# Altium project PROC154E3_SCH.PrjPcb (part 7 of 60)
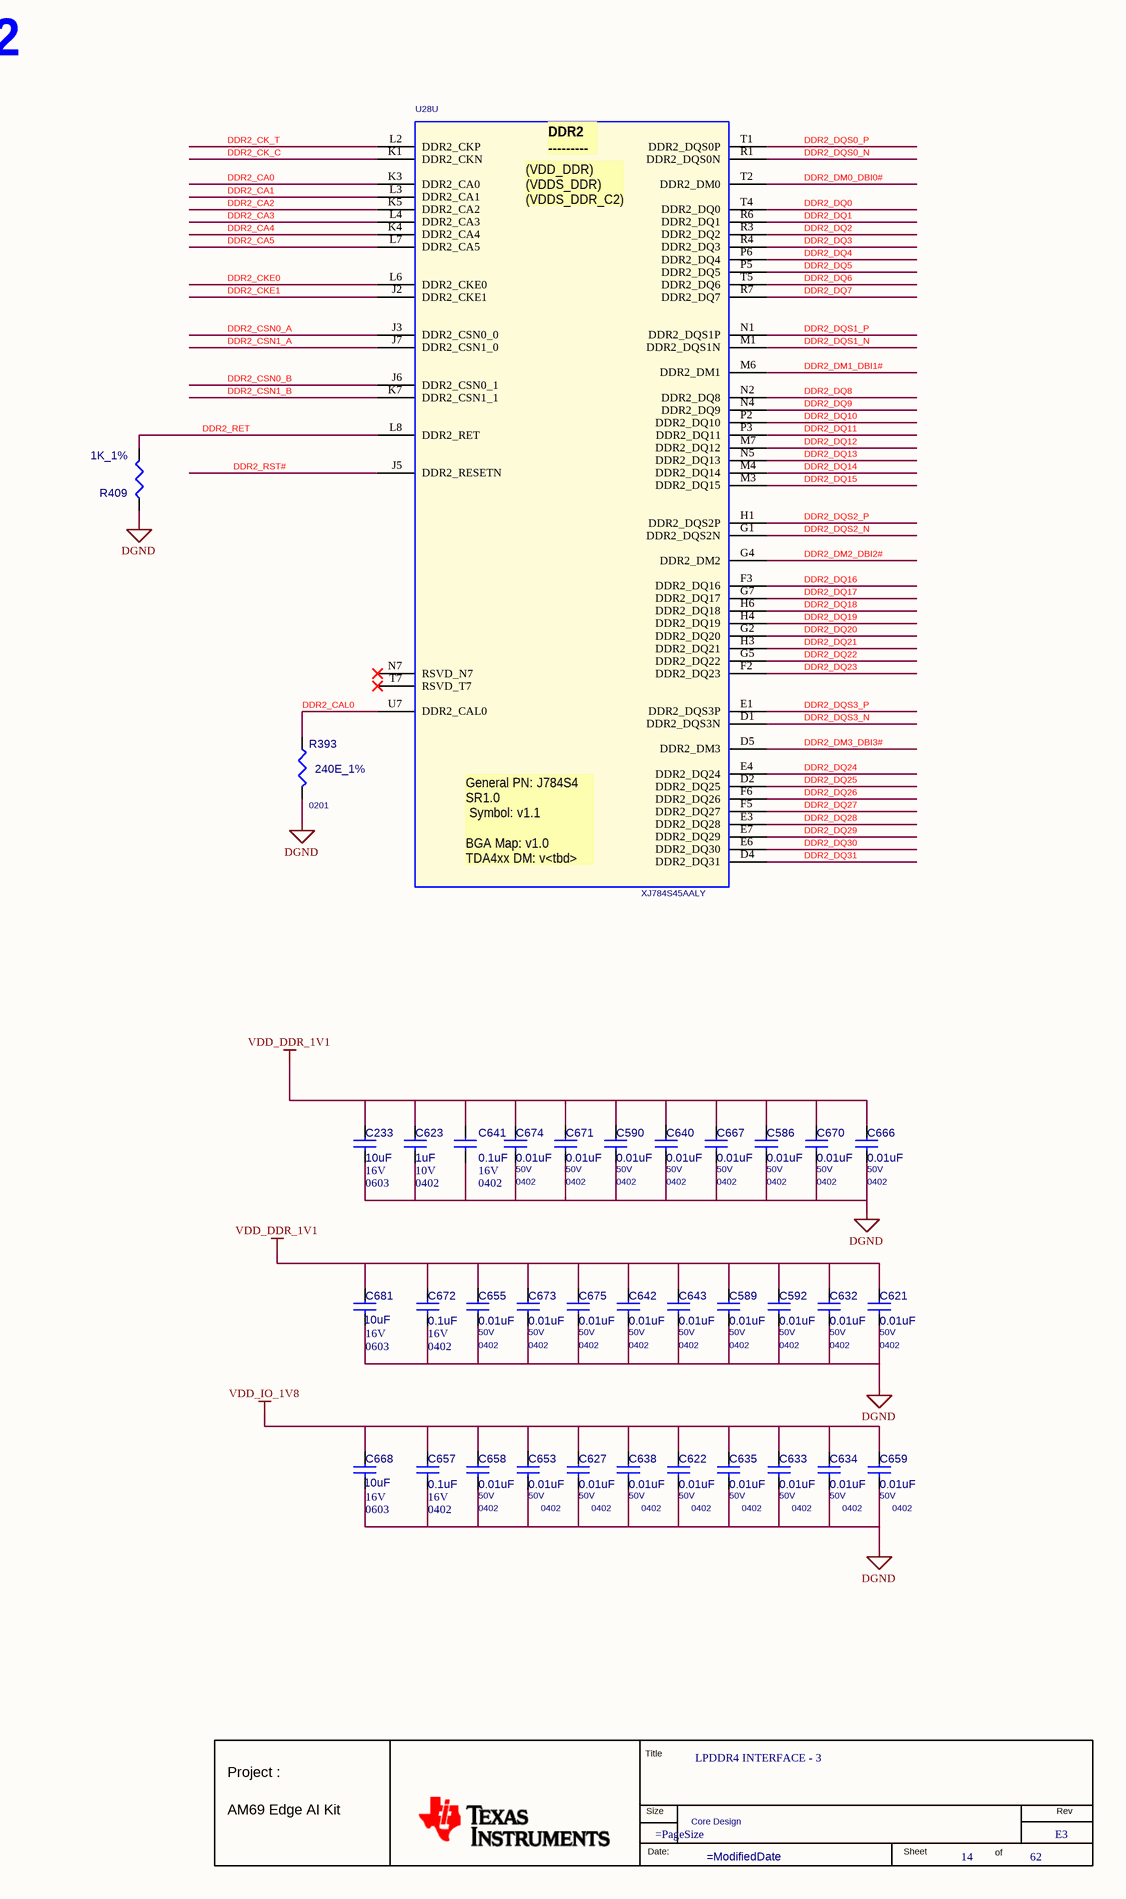
[diagram p121: 14. SOC EMIF2 & LPDDR4.SchDoc, right]

## Sheet 14. SOC EMIF2 & LPDDR4.SchDoc: LPDDR4 INTERFACE - 3 (continued)

### Library data of the parts
*#14 = MISTRAL_TITLEBLK_CSIZE_1: Issue: 1.0; Project: PROC154E2(001)_SK_AM69; Name: PROC154E2 001 SK AM69; Page Create Date: March  8, 1995; Page Size: =PageSize; Page Modify Date: =ModifiedDate; Schematic Page Count: 62; Schematic Page Number: 14
C233 = CAP_Dup1: CAP CERAMIC 10uF 16V 20% X6S 0603; Part Reference: C233; Automotive Alternate_mfr_part_number: GRT188C81C106ME13D; Automotive Alternate_mfr_name: MURATA; Direct Alternate_mfr_part_number: CL10X106MO8NRNC; Direct Alternate_mfr_name: SAMSUNG; Part_type: CAPACITORS\CERAMIC; Mfr_part_number: GRM188C81C106MA73D; Mistral Part No: 120017010004-R; Custom_Duty: 15%; Customs_HS_Code: 85322990; Wattage: NA; Project: TRMM_SMART-M_PS; Value: 10uF; PCB Footprint: CAP0603_1; Footprint Path: Y:\MIS_DATABASE\Library\ALTIUM_TOOL\PCB_FOOTPRINTS\Altium_Footprint_Lib.PcbLib; Library Path: Y:\MIS_DATABASE\Library\ALTIUM_TOOL\SCHEMATICS_PARTS\MS_DISCRETE_Library.schlib; Footprint Ref: CAP0603_1; MECHANICAL 3D STEP FILE: CAP0603_1; Chkd/date: VASANTHA/170117; Crtd /date: VASANTHA/170117; Datasheet: Y:\MIS_DATABASE\DATASHEETS\CAPACITORS\MURATA-GXX-SER_NOV17.PDF; Temperature: -55°C+105°C; Weight: 6.3mg; Height: 0.90MM; Library Ref: CAP; Distributor_part_number: 490-7198-1-ND; Distributor_name: DIGIKEY; Tolerance: 20%; Mfr_name: MURATA
C586 = CAP_Dup1: CAP CERAMIC 0.01uF 50V 10% X7R 0402; Part Reference: C586; Automotive Alternate_mfr_part_number: CGA2B3X7R1H103K050BB; Automotive Alternate_mfr_name: TDK; Direct Alternate_mfr_part_number: C1005X7R1H103K050BE; Mistral Part No: 120009030025-R; Mfr_name: KEMET; Mfr_part_number: C0402C103K5RACTU; Part_type: CAPACITORS\CERAMIC; Wattage: NA; Project: G4_SVGA; Customs_HS_Code: 85322990; Custom_Duty: 15%; Value: 0.01uF; PCB Footprint: CAP0402_0-75; Direct Alternate_mfr_name: TDK; Footprint Path: Y:\MIS_DATABASE\Library\ALTIUM_TOOL\PCB_FOOTPRINTS\Altium_Footprint_Lib.PcbLib; Library Path: Y:\MIS_DATABASE\Library\ALTIUM_TOOL\SCHEMATICS_PARTS\MS_DISCRETE_Library.schlib; MECHANICAL 3D STEP FILE: CAP0402_0-75; Temperature: -55°C+125°C; Weight: 0.65mg; Footprint Ref: CAP0402_0-75; Tolerance: 10%; Distributor_name: DIGIKEY; Distributor_part_number: 399-3066-1-ND; Library Ref: CAP; Height: 0.55MM; Datasheet: Y:\MIS_DATABASE\DATASHEETS\CAPACITORS\KEMET-C-X7R.PDF; Crtd /date: MAZHAR/040505; Chkd/date: SHREESHAIL/301105
C589 = CAP_Dup1: CAP CERAMIC 0.01uF 50V 10% X7R 0402; Part Reference: C589; Automotive Alternate_mfr_part_number: CGA2B3X7R1H103K050BB; Automotive Alternate_mfr_name: TDK; Direct Alternate_mfr_part_number: C1005X7R1H103K050BE; Mistral Part No: 120009030025-R; Mfr_name: KEMET; Mfr_part_number: C0402C103K5RACTU; Part_type: CAPACITORS\CERAMIC; Wattage: NA; Project: G4_SVGA; Customs_HS_Code: 85322990; Custom_Duty: 15%; Value: 0.01uF; PCB Footprint: CAP0402_0-75; Direct Alternate_mfr_name: TDK; Footprint Path: Y:\MIS_DATABASE\Library\ALTIUM_TOOL\PCB_FOOTPRINTS\Altium_Footprint_Lib.PcbLib; Library Path: Y:\MIS_DATABASE\Library\ALTIUM_TOOL\SCHEMATICS_PARTS\MS_DISCRETE_Library.schlib; MECHANICAL 3D STEP FILE: CAP0402_0-75; Temperature: -55°C+125°C; Weight: 0.65mg; Footprint Ref: CAP0402_0-75; Tolerance: 10%; Distributor_name: DIGIKEY; Distributor_part_number: 399-3066-1-ND; Library Ref: CAP; Height: 0.55MM; Datasheet: Y:\MIS_DATABASE\DATASHEETS\CAPACITORS\KEMET-C-X7R.PDF; Crtd /date: MAZHAR/040505; Chkd/date: SHREESHAIL/301105
C590 = CAP_Dup1: CAP CERAMIC 0.01uF 50V 10% X7R 0402; Part Reference: C590; Automotive Alternate_mfr_part_number: CGA2B3X7R1H103K050BB; Automotive Alternate_mfr_name: TDK; Direct Alternate_mfr_part_number: C1005X7R1H103K050BE; Mistral Part No: 120009030025-R; Mfr_name: KEMET; Mfr_part_number: C0402C103K5RACTU; Part_type: CAPACITORS\CERAMIC; Wattage: NA; Project: G4_SVGA; Customs_HS_Code: 85322990; Custom_Duty: 15%; Value: 0.01uF; PCB Footprint: CAP0402_0-75; Direct Alternate_mfr_name: TDK; Footprint Path: Y:\MIS_DATABASE\Library\ALTIUM_TOOL\PCB_FOOTPRINTS\Altium_Footprint_Lib.PcbLib; Library Path: Y:\MIS_DATABASE\Library\ALTIUM_TOOL\SCHEMATICS_PARTS\MS_DISCRETE_Library.schlib; MECHANICAL 3D STEP FILE: CAP0402_0-75; Temperature: -55°C+125°C; Weight: 0.65mg; Footprint Ref: CAP0402_0-75; Tolerance: 10%; Distributor_name: DIGIKEY; Distributor_part_number: 399-3066-1-ND; Library Ref: CAP; Height: 0.55MM; Datasheet: Y:\MIS_DATABASE\DATASHEETS\CAPACITORS\KEMET-C-X7R.PDF; Crtd /date: MAZHAR/040505; Chkd/date: SHREESHAIL/301105
C592 = CAP_Dup1: CAP CERAMIC 0.01uF 50V 10% X7R 0402; Part Reference: C592; Automotive Alternate_mfr_part_number: CGA2B3X7R1H103K050BB; Automotive Alternate_mfr_name: TDK; Direct Alternate_mfr_part_number: C1005X7R1H103K050BE; Part_type: CAPACITORS\CERAMIC; Mfr_part_number: C0402C103K5RACTU; Mfr_name: KEMET; Mistral Part No: 120009030025-R; Wattage: NA; Custom_Duty: 15%; Customs_HS_Code: 85322990; Project: G4_SVGA; Value: 0.01uF; PCB Footprint: CAP0402_0-75; Direct Alternate_mfr_name: TDK; Footprint Path: Y:\MIS_DATABASE\Library\ALTIUM_TOOL\PCB_FOOTPRINTS\Altium_Footprint_Lib.PcbLib; Library Path: Y:\MIS_DATABASE\Library\ALTIUM_TOOL\SCHEMATICS_PARTS\MS_DISCRETE_Library.schlib; MECHANICAL 3D STEP FILE: CAP0402_0-75; Temperature: -55°C+125°C; Weight: 0.65mg; Footprint Ref: CAP0402_0-75; Chkd/date: SHREESHAIL/301105; Crtd /date: MAZHAR/040505; Datasheet: Y:\MIS_DATABASE\DATASHEETS\CAPACITORS\KEMET-C-X7R.PDF; Height: 0.55MM; Library Ref: CAP; Distributor_part_number: 399-3066-1-ND; Distributor_name: DIGIKEY; Tolerance: 10%
C621 = CAP_Dup1: CAP CERAMIC 0.01uF 50V 10% X7R 0402; Part Reference: C621; Automotive Alternate_mfr_part_number: CGA2B3X7R1H103K050BB; Automotive Alternate_mfr_name: TDK; Direct Alternate_mfr_part_number: C1005X7R1H103K050BE; Part_type: CAPACITORS\CERAMIC; Mfr_part_number: C0402C103K5RACTU; Mfr_name: KEMET; Mistral Part No: 120009030025-R; Wattage: NA; Custom_Duty: 15%; Customs_HS_Code: 85322990; Project: G4_SVGA; Value: 0.01uF; PCB Footprint: CAP0402_0-75; Direct Alternate_mfr_name: TDK; Footprint Path: Y:\MIS_DATABASE\Library\ALTIUM_TOOL\PCB_FOOTPRINTS\Altium_Footprint_Lib.PcbLib; Library Path: Y:\MIS_DATABASE\Library\ALTIUM_TOOL\SCHEMATICS_PARTS\MS_DISCRETE_Library.schlib; MECHANICAL 3D STEP FILE: CAP0402_0-75; Temperature: -55°C+125°C; Weight: 0.65mg; Footprint Ref: CAP0402_0-75; Chkd/date: SHREESHAIL/301105; Crtd /date: MAZHAR/040505; Datasheet: Y:\MIS_DATABASE\DATASHEETS\CAPACITORS\KEMET-C-X7R.PDF; Height: 0.55MM; Library Ref: CAP; Distributor_part_number: 399-3066-1-ND; Distributor_name: DIGIKEY; Tolerance: 10%
C622 = CAP_Dup1: CAP CERAMIC 0.01uF 50V 10% X7R 0402; Part Reference: C622; Automotive Alternate_mfr_part_number: CGA2B3X7R1H103K050BB; Automotive Alternate_mfr_name: TDK; Direct Alternate_mfr_part_number: C1005X7R1H103K050BE; Mistral Part No: 120009030025-R; Mfr_name: KEMET; Mfr_part_number: C0402C103K5RACTU; Part_type: CAPACITORS\CERAMIC; Wattage: NA; Project: G4_SVGA; Customs_HS_Code: 85322990; Custom_Duty: 15%; Value: 0.01uF; PCB Footprint: CAP0402_0-75; Direct Alternate_mfr_name: TDK; Footprint Path: Y:\MIS_DATABASE\Library\ALTIUM_TOOL\PCB_FOOTPRINTS\Altium_Footprint_Lib.PcbLib; Library Path: Y:\MIS_DATABASE\Library\ALTIUM_TOOL\SCHEMATICS_PARTS\MS_DISCRETE_Library.schlib; MECHANICAL 3D STEP FILE: CAP0402_0-75; Temperature: -55°C+125°C; Weight: 0.65mg; Footprint Ref: CAP0402_0-75; Tolerance: 10%; Distributor_name: DIGIKEY; Distributor_part_number: 399-3066-1-ND; Library Ref: CAP; Height: 0.55MM; Datasheet: Y:\MIS_DATABASE\DATASHEETS\CAPACITORS\KEMET-C-X7R.PDF; Crtd /date: MAZHAR/040505; Chkd/date: SHREESHAIL/301105
C623 = CAP_Dup1: CAP CERAMIC 1uF 10V 10% X7S AUTO 0402; Part Reference: C623; Mistral Part No: 120018090021-R; Mfr_name: MURATA; Mfr_part_number: GCM155C71A105KE38D; Part_type: CAPACITORS\CERAMIC; Project: SMART-M_SCRIPTALK_PB; Wattage: NA; Customs_HS_Code: 85322990; Custom_Duty: 15%; Value: 1uF; PCB Footprint: CAP0402_0-75; Footprint Ref: CAP0402_0-75; Library Ref: CAP; Tolerance: 10%; Distributor_name: DIGIKEY; Distributor_part_number: 490-13409-1-ND; Height: 0.70MM; Weight: 6mg; Temperature: -55°C+125°C; Datasheet: Y:\MIS_DATABASE\DATASHEETS\CAPACITORS\MURATA-GCM-SER.PDF; Crtd /date: ALVY/100918; Chkd/date: MANIRAJA/100918; MECHANICAL 3D STEP FILE: CAP0402_0-75; Library Path: Y:\MIS_DATABASE\Library\ALTIUM_TOOL\SCHEMATICS_PARTS\MS_DISCRETE_Library.schlib; Footprint Path: Y:\MIS_DATABASE\Library\ALTIUM_TOOL\PCB_FOOTPRINTS\Altium_Footprint_Lib.PcbLib
C627 = CAP_Dup1: CAP CERAMIC 0.01uF 50V 10% X7R 0402; Part Reference: C627; Automotive Alternate_mfr_part_number: CGA2B3X7R1H103K050BB; Automotive Alternate_mfr_name: TDK; Direct Alternate_mfr_part_number: C1005X7R1H103K050BE; Part_type: CAPACITORS\CERAMIC; Mfr_part_number: C0402C103K5RACTU; Mfr_name: KEMET; Mistral Part No: 120009030025-R; Wattage: NA; Custom_Duty: 15%; Customs_HS_Code: 85322990; Project: G4_SVGA; Value: 0.01uF; PCB Footprint: CAP0402_0-75; Direct Alternate_mfr_name: TDK; Footprint Path: Y:\MIS_DATABASE\Library\ALTIUM_TOOL\PCB_FOOTPRINTS\Altium_Footprint_Lib.PcbLib; Library Path: Y:\MIS_DATABASE\Library\ALTIUM_TOOL\SCHEMATICS_PARTS\MS_DISCRETE_Library.schlib; MECHANICAL 3D STEP FILE: CAP0402_0-75; Temperature: -55°C+125°C; Weight: 0.65mg; Footprint Ref: CAP0402_0-75; Chkd/date: SHREESHAIL/301105; Crtd /date: MAZHAR/040505; Datasheet: Y:\MIS_DATABASE\DATASHEETS\CAPACITORS\KEMET-C-X7R.PDF; Height: 0.55MM; Library Ref: CAP; Distributor_part_number: 399-3066-1-ND; Distributor_name: DIGIKEY; Tolerance: 10%
C632 = CAP_Dup1: CAP CERAMIC 0.01uF 50V 10% X7R 0402; Part Reference: C632; Automotive Alternate_mfr_part_number: CGA2B3X7R1H103K050BB; Automotive Alternate_mfr_name: TDK; Direct Alternate_mfr_part_number: C1005X7R1H103K050BE; Mistral Part No: 120009030025-R; Mfr_name: KEMET; Mfr_part_number: C0402C103K5RACTU; Part_type: CAPACITORS\CERAMIC; Wattage: NA; Project: G4_SVGA; Customs_HS_Code: 85322990; Custom_Duty: 15%; Value: 0.01uF; PCB Footprint: CAP0402_0-75; Direct Alternate_mfr_name: TDK; Footprint Path: Y:\MIS_DATABASE\Library\ALTIUM_TOOL\PCB_FOOTPRINTS\Altium_Footprint_Lib.PcbLib; Library Path: Y:\MIS_DATABASE\Library\ALTIUM_TOOL\SCHEMATICS_PARTS\MS_DISCRETE_Library.schlib; MECHANICAL 3D STEP FILE: CAP0402_0-75; Temperature: -55°C+125°C; Weight: 0.65mg; Footprint Ref: CAP0402_0-75; Tolerance: 10%; Distributor_name: DIGIKEY; Distributor_part_number: 399-3066-1-ND; Library Ref: CAP; Height: 0.55MM; Datasheet: Y:\MIS_DATABASE\DATASHEETS\CAPACITORS\KEMET-C-X7R.PDF; Crtd /date: MAZHAR/040505; Chkd/date: SHREESHAIL/301105
C633 = CAP_Dup1: CAP CERAMIC 0.01uF 50V 10% X7R 0402; Part Reference: C633; Automotive Alternate_mfr_part_number: CGA2B3X7R1H103K050BB; Automotive Alternate_mfr_name: TDK; Direct Alternate_mfr_part_number: C1005X7R1H103K050BE; Mistral Part No: 120009030025-R; Mfr_name: KEMET; Mfr_part_number: C0402C103K5RACTU; Part_type: CAPACITORS\CERAMIC; Wattage: NA; Project: G4_SVGA; Customs_HS_Code: 85322990; Custom_Duty: 15%; Value: 0.01uF; PCB Footprint: CAP0402_0-75; Direct Alternate_mfr_name: TDK; Footprint Path: Y:\MIS_DATABASE\Library\ALTIUM_TOOL\PCB_FOOTPRINTS\Altium_Footprint_Lib.PcbLib; Library Path: Y:\MIS_DATABASE\Library\ALTIUM_TOOL\SCHEMATICS_PARTS\MS_DISCRETE_Library.schlib; MECHANICAL 3D STEP FILE: CAP0402_0-75; Temperature: -55°C+125°C; Weight: 0.65mg; Footprint Ref: CAP0402_0-75; Tolerance: 10%; Distributor_name: DIGIKEY; Distributor_part_number: 399-3066-1-ND; Library Ref: CAP; Height: 0.55MM; Datasheet: Y:\MIS_DATABASE\DATASHEETS\CAPACITORS\KEMET-C-X7R.PDF; Crtd /date: MAZHAR/040505; Chkd/date: SHREESHAIL/301105
C634 = CAP_Dup1: CAP CERAMIC 0.01uF 50V 10% X7R 0402; Part Reference: C634; Automotive Alternate_mfr_part_number: CGA2B3X7R1H103K050BB; Automotive Alternate_mfr_name: TDK; Direct Alternate_mfr_part_number: C1005X7R1H103K050BE; Part_type: CAPACITORS\CERAMIC; Mfr_part_number: C0402C103K5RACTU; Mfr_name: KEMET; Mistral Part No: 120009030025-R; Wattage: NA; Custom_Duty: 15%; Customs_HS_Code: 85322990; Project: G4_SVGA; Value: 0.01uF; PCB Footprint: CAP0402_0-75; Direct Alternate_mfr_name: TDK; Footprint Path: Y:\MIS_DATABASE\Library\ALTIUM_TOOL\PCB_FOOTPRINTS\Altium_Footprint_Lib.PcbLib; Library Path: Y:\MIS_DATABASE\Library\ALTIUM_TOOL\SCHEMATICS_PARTS\MS_DISCRETE_Library.schlib; MECHANICAL 3D STEP FILE: CAP0402_0-75; Temperature: -55°C+125°C; Weight: 0.65mg; Footprint Ref: CAP0402_0-75; Chkd/date: SHREESHAIL/301105; Crtd /date: MAZHAR/040505; Datasheet: Y:\MIS_DATABASE\DATASHEETS\CAPACITORS\KEMET-C-X7R.PDF; Height: 0.55MM; Library Ref: CAP; Distributor_part_number: 399-3066-1-ND; Distributor_name: DIGIKEY; Tolerance: 10%
C635 = CAP_Dup1: CAP CERAMIC 0.01uF 50V 10% X7R 0402; Part Reference: C635; Automotive Alternate_mfr_part_number: CGA2B3X7R1H103K050BB; Automotive Alternate_mfr_name: TDK; Direct Alternate_mfr_part_number: C1005X7R1H103K050BE; Part_type: CAPACITORS\CERAMIC; Mfr_part_number: C0402C103K5RACTU; Mfr_name: KEMET; Mistral Part No: 120009030025-R; Wattage: NA; Custom_Duty: 15%; Customs_HS_Code: 85322990; Project: G4_SVGA; Value: 0.01uF; PCB Footprint: CAP0402_0-75; Direct Alternate_mfr_name: TDK; Footprint Path: Y:\MIS_DATABASE\Library\ALTIUM_TOOL\PCB_FOOTPRINTS\Altium_Footprint_Lib.PcbLib; Library Path: Y:\MIS_DATABASE\Library\ALTIUM_TOOL\SCHEMATICS_PARTS\MS_DISCRETE_Library.schlib; MECHANICAL 3D STEP FILE: CAP0402_0-75; Temperature: -55°C+125°C; Weight: 0.65mg; Footprint Ref: CAP0402_0-75; Chkd/date: SHREESHAIL/301105; Crtd /date: MAZHAR/040505; Datasheet: Y:\MIS_DATABASE\DATASHEETS\CAPACITORS\KEMET-C-X7R.PDF; Height: 0.55MM; Library Ref: CAP; Distributor_part_number: 399-3066-1-ND; Distributor_name: DIGIKEY; Tolerance: 10%
C638 = CAP_Dup1: CAP CERAMIC 0.01uF 50V 10% X7R 0402; Part Reference: C638; Automotive Alternate_mfr_part_number: CGA2B3X7R1H103K050BB; Automotive Alternate_mfr_name: TDK; Direct Alternate_mfr_part_number: C1005X7R1H103K050BE; Part_type: CAPACITORS\CERAMIC; Mfr_part_number: C0402C103K5RACTU; Mfr_name: KEMET; Mistral Part No: 120009030025-R; Wattage: NA; Custom_Duty: 15%; Customs_HS_Code: 85322990; Project: G4_SVGA; Value: 0.01uF; PCB Footprint: CAP0402_0-75; Direct Alternate_mfr_name: TDK; Footprint Path: Y:\MIS_DATABASE\Library\ALTIUM_TOOL\PCB_FOOTPRINTS\Altium_Footprint_Lib.PcbLib; Library Path: Y:\MIS_DATABASE\Library\ALTIUM_TOOL\SCHEMATICS_PARTS\MS_DISCRETE_Library.schlib; MECHANICAL 3D STEP FILE: CAP0402_0-75; Temperature: -55°C+125°C; Weight: 0.65mg; Footprint Ref: CAP0402_0-75; Chkd/date: SHREESHAIL/301105; Crtd /date: MAZHAR/040505; Datasheet: Y:\MIS_DATABASE\DATASHEETS\CAPACITORS\KEMET-C-X7R.PDF; Height: 0.55MM; Library Ref: CAP; Distributor_part_number: 399-3066-1-ND; Distributor_name: DIGIKEY; Tolerance: 10%
C640 = CAP_Dup1: CAP CERAMIC 0.01uF 50V 10% X7R 0402; Part Reference: C640; Automotive Alternate_mfr_part_number: CGA2B3X7R1H103K050BB; Automotive Alternate_mfr_name: TDK; Direct Alternate_mfr_part_number: C1005X7R1H103K050BE; Mistral Part No: 120009030025-R; Mfr_name: KEMET; Mfr_part_number: C0402C103K5RACTU; Part_type: CAPACITORS\CERAMIC; Wattage: NA; Project: G4_SVGA; Customs_HS_Code: 85322990; Custom_Duty: 15%; Value: 0.01uF; PCB Footprint: CAP0402_0-75; Direct Alternate_mfr_name: TDK; Footprint Path: Y:\MIS_DATABASE\Library\ALTIUM_TOOL\PCB_FOOTPRINTS\Altium_Footprint_Lib.PcbLib; Library Path: Y:\MIS_DATABASE\Library\ALTIUM_TOOL\SCHEMATICS_PARTS\MS_DISCRETE_Library.schlib; MECHANICAL 3D STEP FILE: CAP0402_0-75; Temperature: -55°C+125°C; Weight: 0.65mg; Footprint Ref: CAP0402_0-75; Tolerance: 10%; Distributor_name: DIGIKEY; Distributor_part_number: 399-3066-1-ND; Library Ref: CAP; Height: 0.55MM; Datasheet: Y:\MIS_DATABASE\DATASHEETS\CAPACITORS\KEMET-C-X7R.PDF; Crtd /date: MAZHAR/040505; Chkd/date: SHREESHAIL/301105
C641 = CAP_Dup1: CAP CERAMIC 0.1uF 16V 5% X7R AUTO 0402; Part Reference: C641; Automotive Alternate_mfr_part_number: CGA2B1X7R1C104K050BC; Automotive Alternate_mfr_name: TDK; Mistral Part No: 120018100055-R; Mfr_name: MURATA; Mfr_part_number: GCM155R71C104JA55D; Part_type: CAPACITORS\CERAMIC; Project: TI_J7ES_EVM_CP; Wattage: NA; Customs_HS_Code: 85322990; Custom_Duty: 15%; Value: 0.1uF; PCB Footprint: CAP0402_0-75; Direct Alternate_mfr_part_number: CGA2B1X7R1C104K050BC; Direct Alternate_mfr_name: TDK; Tolerance: 5%; Distributor_name: DIGIKEY; Distributor_part_number: 490-16433-1-ND; Height: 0.55MM; Weight: 6mg; Temperature: -55°C+125°C; Datasheet: Y:\MIS_DATABASE\DATASHEETS\CAPACITORS\GCM155R71C104JA55D.PDF; Crtd /date: ALVY/241018; Chkd/date: MANIRAJA/241018; Library Ref: CAP; Footprint Ref: CAP0402_0-75; Library Path: Y:\MIS_DATABASE\Library\ALTIUM_TOOL\SCHEMATICS_PARTS\MS_DISCRETE_Library.schlib; Footprint Path: Y:\MIS_DATABASE\Library\ALTIUM_TOOL\PCB_FOOTPRINTS\Altium_Footprint_Lib.PcbLib; MECHANICAL 3D STEP FILE: CAP0402_0-75
C642 = CAP_Dup1: CAP CERAMIC 0.01uF 50V 10% X7R 0402; Part Reference: C642; Automotive Alternate_mfr_part_number: CGA2B3X7R1H103K050BB; Automotive Alternate_mfr_name: TDK; Direct Alternate_mfr_part_number: C1005X7R1H103K050BE; Part_type: CAPACITORS\CERAMIC; Mfr_part_number: C0402C103K5RACTU; Mfr_name: KEMET; Mistral Part No: 120009030025-R; Wattage: NA; Custom_Duty: 15%; Customs_HS_Code: 85322990; Project: G4_SVGA; Value: 0.01uF; PCB Footprint: CAP0402_0-75; Direct Alternate_mfr_name: TDK; Footprint Path: Y:\MIS_DATABASE\Library\ALTIUM_TOOL\PCB_FOOTPRINTS\Altium_Footprint_Lib.PcbLib; Library Path: Y:\MIS_DATABASE\Library\ALTIUM_TOOL\SCHEMATICS_PARTS\MS_DISCRETE_Library.schlib; MECHANICAL 3D STEP FILE: CAP0402_0-75; Temperature: -55°C+125°C; Weight: 0.65mg; Footprint Ref: CAP0402_0-75; Chkd/date: SHREESHAIL/301105; Crtd /date: MAZHAR/040505; Datasheet: Y:\MIS_DATABASE\DATASHEETS\CAPACITORS\KEMET-C-X7R.PDF; Height: 0.55MM; Library Ref: CAP; Distributor_part_number: 399-3066-1-ND; Distributor_name: DIGIKEY; Tolerance: 10%
C643 = CAP_Dup1: CAP CERAMIC 0.01uF 50V 10% X7R 0402; Part Reference: C643; Automotive Alternate_mfr_part_number: CGA2B3X7R1H103K050BB; Automotive Alternate_mfr_name: TDK; Direct Alternate_mfr_part_number: C1005X7R1H103K050BE; Mistral Part No: 120009030025-R; Mfr_name: KEMET; Mfr_part_number: C0402C103K5RACTU; Part_type: CAPACITORS\CERAMIC; Wattage: NA; Project: G4_SVGA; Customs_HS_Code: 85322990; Custom_Duty: 15%; Value: 0.01uF; PCB Footprint: CAP0402_0-75; Direct Alternate_mfr_name: TDK; Footprint Path: Y:\MIS_DATABASE\Library\ALTIUM_TOOL\PCB_FOOTPRINTS\Altium_Footprint_Lib.PcbLib; Library Path: Y:\MIS_DATABASE\Library\ALTIUM_TOOL\SCHEMATICS_PARTS\MS_DISCRETE_Library.schlib; MECHANICAL 3D STEP FILE: CAP0402_0-75; Temperature: -55°C+125°C; Weight: 0.65mg; Footprint Ref: CAP0402_0-75; Tolerance: 10%; Distributor_name: DIGIKEY; Distributor_part_number: 399-3066-1-ND; Library Ref: CAP; Height: 0.55MM; Datasheet: Y:\MIS_DATABASE\DATASHEETS\CAPACITORS\KEMET-C-X7R.PDF; Crtd /date: MAZHAR/040505; Chkd/date: SHREESHAIL/301105
C653 = CAP_Dup1: CAP CERAMIC 0.01uF 50V 10% X7R 0402; Part Reference: C653; Automotive Alternate_mfr_part_number: CGA2B3X7R1H103K050BB; Automotive Alternate_mfr_name: TDK; Direct Alternate_mfr_part_number: C1005X7R1H103K050BE; Part_type: CAPACITORS\CERAMIC; Mfr_part_number: C0402C103K5RACTU; Mfr_name: KEMET; Mistral Part No: 120009030025-R; Wattage: NA; Custom_Duty: 15%; Customs_HS_Code: 85322990; Project: G4_SVGA; Value: 0.01uF; PCB Footprint: CAP0402_0-75; Direct Alternate_mfr_name: TDK; Footprint Path: Y:\MIS_DATABASE\Library\ALTIUM_TOOL\PCB_FOOTPRINTS\Altium_Footprint_Lib.PcbLib; Library Path: Y:\MIS_DATABASE\Library\ALTIUM_TOOL\SCHEMATICS_PARTS\MS_DISCRETE_Library.schlib; MECHANICAL 3D STEP FILE: CAP0402_0-75; Temperature: -55°C+125°C; Weight: 0.65mg; Footprint Ref: CAP0402_0-75; Chkd/date: SHREESHAIL/301105; Crtd /date: MAZHAR/040505; Datasheet: Y:\MIS_DATABASE\DATASHEETS\CAPACITORS\KEMET-C-X7R.PDF; Height: 0.55MM; Library Ref: CAP; Distributor_part_number: 399-3066-1-ND; Distributor_name: DIGIKEY; Tolerance: 10%
C655 = CAP_Dup1: CAP CERAMIC 0.01uF 50V 10% X7R 0402; Part Reference: C655; Automotive Alternate_mfr_part_number: CGA2B3X7R1H103K050BB; Automotive Alternate_mfr_name: TDK; Direct Alternate_mfr_part_number: C1005X7R1H103K050BE; Part_type: CAPACITORS\CERAMIC; Mfr_part_number: C0402C103K5RACTU; Mfr_name: KEMET; Mistral Part No: 120009030025-R; Wattage: NA; Custom_Duty: 15%; Customs_HS_Code: 85322990; Project: G4_SVGA; Value: 0.01uF; PCB Footprint: CAP0402_0-75; Direct Alternate_mfr_name: TDK; Footprint Path: Y:\MIS_DATABASE\Library\ALTIUM_TOOL\PCB_FOOTPRINTS\Altium_Footprint_Lib.PcbLib; Library Path: Y:\MIS_DATABASE\Library\ALTIUM_TOOL\SCHEMATICS_PARTS\MS_DISCRETE_Library.schlib; MECHANICAL 3D STEP FILE: CAP0402_0-75; Temperature: -55°C+125°C; Weight: 0.65mg; Footprint Ref: CAP0402_0-75; Chkd/date: SHREESHAIL/301105; Crtd /date: MAZHAR/040505; Datasheet: Y:\MIS_DATABASE\DATASHEETS\CAPACITORS\KEMET-C-X7R.PDF; Height: 0.55MM; Library Ref: CAP; Distributor_part_number: 399-3066-1-ND; Distributor_name: DIGIKEY; Tolerance: 10%
C657 = CAP_Dup1: CAP CERAMIC 0.1uF 16V 5% X7R AUTO 0402; Part Reference: C657; Automotive Alternate_mfr_part_number: CGA2B1X7R1C104K050BC; Automotive Alternate_mfr_name: TDK; Mistral Part No: 120018100055-R; Mfr_name: MURATA; Mfr_part_number: GCM155R71C104JA55D; Part_type: CAPACITORS\CERAMIC; Project: TI_J7ES_EVM_CP; Wattage: NA; Customs_HS_Code: 85322990; Custom_Duty: 15%; Value: 0.1uF; PCB Footprint: CAP0402_0-75; Direct Alternate_mfr_part_number: CGA2B1X7R1C104K050BC; Direct Alternate_mfr_name: TDK; Tolerance: 5%; Distributor_name: DIGIKEY; Distributor_part_number: 490-16433-1-ND; Height: 0.55MM; Weight: 6mg; Temperature: -55°C+125°C; Datasheet: Y:\MIS_DATABASE\DATASHEETS\CAPACITORS\GCM155R71C104JA55D.PDF; Crtd /date: ALVY/241018; Chkd/date: MANIRAJA/241018; Library Ref: CAP; Footprint Ref: CAP0402_0-75; Library Path: Y:\MIS_DATABASE\Library\ALTIUM_TOOL\SCHEMATICS_PARTS\MS_DISCRETE_Library.schlib; Footprint Path: Y:\MIS_DATABASE\Library\ALTIUM_TOOL\PCB_FOOTPRINTS\Altium_Footprint_Lib.PcbLib; MECHANICAL 3D STEP FILE: CAP0402_0-75
C658 = CAP_Dup1: CAP CERAMIC 0.01uF 50V 10% X7R 0402; Part Reference: C658; Automotive Alternate_mfr_part_number: CGA2B3X7R1H103K050BB; Automotive Alternate_mfr_name: TDK; Direct Alternate_mfr_part_number: C1005X7R1H103K050BE; Mistral Part No: 120009030025-R; Mfr_name: KEMET; Mfr_part_number: C0402C103K5RACTU; Part_type: CAPACITORS\CERAMIC; Wattage: NA; Project: G4_SVGA; Customs_HS_Code: 85322990; Custom_Duty: 15%; Value: 0.01uF; PCB Footprint: CAP0402_0-75; Direct Alternate_mfr_name: TDK; Footprint Path: Y:\MIS_DATABASE\Library\ALTIUM_TOOL\PCB_FOOTPRINTS\Altium_Footprint_Lib.PcbLib; Library Path: Y:\MIS_DATABASE\Library\ALTIUM_TOOL\SCHEMATICS_PARTS\MS_DISCRETE_Library.schlib; MECHANICAL 3D STEP FILE: CAP0402_0-75; Temperature: -55°C+125°C; Weight: 0.65mg; Footprint Ref: CAP0402_0-75; Tolerance: 10%; Distributor_name: DIGIKEY; Distributor_part_number: 399-3066-1-ND; Library Ref: CAP; Height: 0.55MM; Datasheet: Y:\MIS_DATABASE\DATASHEETS\CAPACITORS\KEMET-C-X7R.PDF; Crtd /date: MAZHAR/040505; Chkd/date: SHREESHAIL/301105
C659 = CAP_Dup1: CAP CERAMIC 0.01uF 50V 10% X7R 0402; Part Reference: C659; Automotive Alternate_mfr_part_number: CGA2B3X7R1H103K050BB; Automotive Alternate_mfr_name: TDK; Direct Alternate_mfr_part_number: C1005X7R1H103K050BE; Mistral Part No: 120009030025-R; Mfr_name: KEMET; Mfr_part_number: C0402C103K5RACTU; Part_type: CAPACITORS\CERAMIC; Wattage: NA; Project: G4_SVGA; Customs_HS_Code: 85322990; Custom_Duty: 15%; Value: 0.01uF; PCB Footprint: CAP0402_0-75; Direct Alternate_mfr_name: TDK; Footprint Path: Y:\MIS_DATABASE\Library\ALTIUM_TOOL\PCB_FOOTPRINTS\Altium_Footprint_Lib.PcbLib; Library Path: Y:\MIS_DATABASE\Library\ALTIUM_TOOL\SCHEMATICS_PARTS\MS_DISCRETE_Library.schlib; MECHANICAL 3D STEP FILE: CAP0402_0-75; Temperature: -55°C+125°C; Weight: 0.65mg; Footprint Ref: CAP0402_0-75; Tolerance: 10%; Distributor_name: DIGIKEY; Distributor_part_number: 399-3066-1-ND; Library Ref: CAP; Height: 0.55MM; Datasheet: Y:\MIS_DATABASE\DATASHEETS\CAPACITORS\KEMET-C-X7R.PDF; Crtd /date: MAZHAR/040505; Chkd/date: SHREESHAIL/301105
C666 = CAP_Dup1: CAP CERAMIC 0.01uF 50V 10% X7R 0402; Part Reference: C666; Automotive Alternate_mfr_part_number: CGA2B3X7R1H103K050BB; Automotive Alternate_mfr_name: TDK; Direct Alternate_mfr_part_number: C1005X7R1H103K050BE; Part_type: CAPACITORS\CERAMIC; Mfr_part_number: C0402C103K5RACTU; Mfr_name: KEMET; Mistral Part No: 120009030025-R; Wattage: NA; Custom_Duty: 15%; Customs_HS_Code: 85322990; Project: G4_SVGA; Value: 0.01uF; PCB Footprint: CAP0402_0-75; Direct Alternate_mfr_name: TDK; Footprint Path: Y:\MIS_DATABASE\Library\ALTIUM_TOOL\PCB_FOOTPRINTS\Altium_Footprint_Lib.PcbLib; Library Path: Y:\MIS_DATABASE\Library\ALTIUM_TOOL\SCHEMATICS_PARTS\MS_DISCRETE_Library.schlib; MECHANICAL 3D STEP FILE: CAP0402_0-75; Temperature: -55°C+125°C; Weight: 0.65mg; Footprint Ref: CAP0402_0-75; Chkd/date: SHREESHAIL/301105; Crtd /date: MAZHAR/040505; Datasheet: Y:\MIS_DATABASE\DATASHEETS\CAPACITORS\KEMET-C-X7R.PDF; Height: 0.55MM; Library Ref: CAP; Distributor_part_number: 399-3066-1-ND; Distributor_name: DIGIKEY; Tolerance: 10%
C667 = CAP_Dup1: CAP CERAMIC 0.01uF 50V 10% X7R 0402; Part Reference: C667; Automotive Alternate_mfr_part_number: CGA2B3X7R1H103K050BB; Automotive Alternate_mfr_name: TDK; Direct Alternate_mfr_part_number: C1005X7R1H103K050BE; Mistral Part No: 120009030025-R; Mfr_name: KEMET; Mfr_part_number: C0402C103K5RACTU; Part_type: CAPACITORS\CERAMIC; Wattage: NA; Project: G4_SVGA; Customs_HS_Code: 85322990; Custom_Duty: 15%; Value: 0.01uF; PCB Footprint: CAP0402_0-75; Direct Alternate_mfr_name: TDK; Footprint Path: Y:\MIS_DATABASE\Library\ALTIUM_TOOL\PCB_FOOTPRINTS\Altium_Footprint_Lib.PcbLib; Library Path: Y:\MIS_DATABASE\Library\ALTIUM_TOOL\SCHEMATICS_PARTS\MS_DISCRETE_Library.schlib; MECHANICAL 3D STEP FILE: CAP0402_0-75; Temperature: -55°C+125°C; Weight: 0.65mg; Footprint Ref: CAP0402_0-75; Tolerance: 10%; Distributor_name: DIGIKEY; Distributor_part_number: 399-3066-1-ND; Library Ref: CAP; Height: 0.55MM; Datasheet: Y:\MIS_DATABASE\DATASHEETS\CAPACITORS\KEMET-C-X7R.PDF; Crtd /date: MAZHAR/040505; Chkd/date: SHREESHAIL/301105
C668 = CAP_Dup1: CAP CERAMIC 10uF 16V 20% X6S 0603; Part Reference: C668; Automotive Alternate_mfr_part_number: GRT188C81C106ME13D; Automotive Alternate_mfr_name: MURATA; Direct Alternate_mfr_part_number: CL10X106MO8NRNC; Direct Alternate_mfr_name: SAMSUNG; Mistral Part No: 120017010004-R; Mfr_part_number: GRM188C81C106MA73D; Part_type: CAPACITORS\CERAMIC; Project: TRMM_SMART-M_PS; Wattage: NA; Customs_HS_Code: 85322990; Custom_Duty: 15%; Value: 10uF; PCB Footprint: CAP0603_1; Footprint Path: Y:\MIS_DATABASE\Library\ALTIUM_TOOL\PCB_FOOTPRINTS\Altium_Footprint_Lib.PcbLib; Library Path: Y:\MIS_DATABASE\Library\ALTIUM_TOOL\SCHEMATICS_PARTS\MS_DISCRETE_Library.schlib; Footprint Ref: CAP0603_1; Mfr_name: MURATA; Tolerance: 20%; Distributor_name: DIGIKEY; Distributor_part_number: 490-7198-1-ND; Library Ref: CAP; Height: 0.90MM; Weight: 6.3mg; Temperature: -55°C+105°C; Datasheet: Y:\MIS_DATABASE\DATASHEETS\CAPACITORS\MURATA-GXX-SER_NOV17.PDF; Crtd /date: VASANTHA/170117; Chkd/date: VASANTHA/170117; MECHANICAL 3D STEP FILE: CAP0603_1
C670 = CAP_Dup1: CAP CERAMIC 0.01uF 50V 10% X7R 0402; Part Reference: C670; Automotive Alternate_mfr_part_number: CGA2B3X7R1H103K050BB; Automotive Alternate_mfr_name: TDK; Direct Alternate_mfr_part_number: C1005X7R1H103K050BE; Mistral Part No: 120009030025-R; Mfr_name: KEMET; Mfr_part_number: C0402C103K5RACTU; Part_type: CAPACITORS\CERAMIC; Wattage: NA; Project: G4_SVGA; Customs_HS_Code: 85322990; Custom_Duty: 15%; Value: 0.01uF; PCB Footprint: CAP0402_0-75; Direct Alternate_mfr_name: TDK; Footprint Path: Y:\MIS_DATABASE\Library\ALTIUM_TOOL\PCB_FOOTPRINTS\Altium_Footprint_Lib.PcbLib; Library Path: Y:\MIS_DATABASE\Library\ALTIUM_TOOL\SCHEMATICS_PARTS\MS_DISCRETE_Library.schlib; MECHANICAL 3D STEP FILE: CAP0402_0-75; Temperature: -55°C+125°C; Weight: 0.65mg; Footprint Ref: CAP0402_0-75; Tolerance: 10%; Distributor_name: DIGIKEY; Distributor_part_number: 399-3066-1-ND; Library Ref: CAP; Height: 0.55MM; Datasheet: Y:\MIS_DATABASE\DATASHEETS\CAPACITORS\KEMET-C-X7R.PDF; Crtd /date: MAZHAR/040505; Chkd/date: SHREESHAIL/301105
C671 = CAP_Dup1: CAP CERAMIC 0.01uF 50V 10% X7R 0402; Part Reference: C671; Automotive Alternate_mfr_part_number: CGA2B3X7R1H103K050BB; Automotive Alternate_mfr_name: TDK; Direct Alternate_mfr_part_number: C1005X7R1H103K050BE; Mistral Part No: 120009030025-R; Mfr_name: KEMET; Mfr_part_number: C0402C103K5RACTU; Part_type: CAPACITORS\CERAMIC; Wattage: NA; Project: G4_SVGA; Customs_HS_Code: 85322990; Custom_Duty: 15%; Value: 0.01uF; PCB Footprint: CAP0402_0-75; Direct Alternate_mfr_name: TDK; Footprint Path: Y:\MIS_DATABASE\Library\ALTIUM_TOOL\PCB_FOOTPRINTS\Altium_Footprint_Lib.PcbLib; Library Path: Y:\MIS_DATABASE\Library\ALTIUM_TOOL\SCHEMATICS_PARTS\MS_DISCRETE_Library.schlib; MECHANICAL 3D STEP FILE: CAP0402_0-75; Temperature: -55°C+125°C; Weight: 0.65mg; Footprint Ref: CAP0402_0-75; Tolerance: 10%; Distributor_name: DIGIKEY; Distributor_part_number: 399-3066-1-ND; Library Ref: CAP; Height: 0.55MM; Datasheet: Y:\MIS_DATABASE\DATASHEETS\CAPACITORS\KEMET-C-X7R.PDF; Crtd /date: MAZHAR/040505; Chkd/date: SHREESHAIL/301105
C672 = CAP_Dup1: CAP CERAMIC 0.1uF 16V 5% X7R AUTO 0402; Part Reference: C672; Automotive Alternate_mfr_part_number: CGA2B1X7R1C104K050BC; Automotive Alternate_mfr_name: TDK; Part_type: CAPACITORS\CERAMIC; Mfr_part_number: GCM155R71C104JA55D; Mfr_name: MURATA; Mistral Part No: 120018100055-R; Custom_Duty: 15%; Customs_HS_Code: 85322990; Wattage: NA; Project: TI_J7ES_EVM_CP; Value: 0.1uF; PCB Footprint: CAP0402_0-75; Direct Alternate_mfr_part_number: CGA2B1X7R1C104K050BC; Direct Alternate_mfr_name: TDK; Footprint Path: Y:\MIS_DATABASE\Library\ALTIUM_TOOL\PCB_FOOTPRINTS\Altium_Footprint_Lib.PcbLib; Library Path: Y:\MIS_DATABASE\Library\ALTIUM_TOOL\SCHEMATICS_PARTS\MS_DISCRETE_Library.schlib; Footprint Ref: CAP0402_0-75; Library Ref: CAP; Chkd/date: MANIRAJA/241018; Crtd /date: ALVY/241018; Datasheet: Y:\MIS_DATABASE\DATASHEETS\CAPACITORS\GCM155R71C104JA55D.PDF; Temperature: -55°C+125°C; Weight: 6mg; Height: 0.55MM; Distributor_part_number: 490-16433-1-ND; Distributor_name: DIGIKEY; Tolerance: 5%; MECHANICAL 3D STEP FILE: CAP0402_0-75
C673 = CAP_Dup1: CAP CERAMIC 0.01uF 50V 10% X7R 0402; Part Reference: C673; Automotive Alternate_mfr_part_number: CGA2B3X7R1H103K050BB; Automotive Alternate_mfr_name: TDK; Direct Alternate_mfr_part_number: C1005X7R1H103K050BE; Part_type: CAPACITORS\CERAMIC; Mfr_part_number: C0402C103K5RACTU; Mfr_name: KEMET; Mistral Part No: 120009030025-R; Wattage: NA; Custom_Duty: 15%; Customs_HS_Code: 85322990; Project: G4_SVGA; Value: 0.01uF; PCB Footprint: CAP0402_0-75; Direct Alternate_mfr_name: TDK; Footprint Path: Y:\MIS_DATABASE\Library\ALTIUM_TOOL\PCB_FOOTPRINTS\Altium_Footprint_Lib.PcbLib; Library Path: Y:\MIS_DATABASE\Library\ALTIUM_TOOL\SCHEMATICS_PARTS\MS_DISCRETE_Library.schlib; MECHANICAL 3D STEP FILE: CAP0402_0-75; Temperature: -55°C+125°C; Weight: 0.65mg; Footprint Ref: CAP0402_0-75; Chkd/date: SHREESHAIL/301105; Crtd /date: MAZHAR/040505; Datasheet: Y:\MIS_DATABASE\DATASHEETS\CAPACITORS\KEMET-C-X7R.PDF; Height: 0.55MM; Library Ref: CAP; Distributor_part_number: 399-3066-1-ND; Distributor_name: DIGIKEY; Tolerance: 10%
C674 = CAP_Dup1: CAP CERAMIC 0.01uF 50V 10% X7R 0402; Part Reference: C674; Automotive Alternate_mfr_part_number: CGA2B3X7R1H103K050BB; Automotive Alternate_mfr_name: TDK; Direct Alternate_mfr_part_number: C1005X7R1H103K050BE; Part_type: CAPACITORS\CERAMIC; Mfr_part_number: C0402C103K5RACTU; Mfr_name: KEMET; Mistral Part No: 120009030025-R; Wattage: NA; Custom_Duty: 15%; Customs_HS_Code: 85322990; Project: G4_SVGA; Value: 0.01uF; PCB Footprint: CAP0402_0-75; Direct Alternate_mfr_name: TDK; Footprint Path: Y:\MIS_DATABASE\Library\ALTIUM_TOOL\PCB_FOOTPRINTS\Altium_Footprint_Lib.PcbLib; Library Path: Y:\MIS_DATABASE\Library\ALTIUM_TOOL\SCHEMATICS_PARTS\MS_DISCRETE_Library.schlib; MECHANICAL 3D STEP FILE: CAP0402_0-75; Temperature: -55°C+125°C; Weight: 0.65mg; Footprint Ref: CAP0402_0-75; Chkd/date: SHREESHAIL/301105; Crtd /date: MAZHAR/040505; Datasheet: Y:\MIS_DATABASE\DATASHEETS\CAPACITORS\KEMET-C-X7R.PDF; Height: 0.55MM; Library Ref: CAP; Distributor_part_number: 399-3066-1-ND; Distributor_name: DIGIKEY; Tolerance: 10%
C675 = CAP_Dup1: CAP CERAMIC 0.01uF 50V 10% X7R 0402; Part Reference: C675; Automotive Alternate_mfr_part_number: CGA2B3X7R1H103K050BB; Automotive Alternate_mfr_name: TDK; Direct Alternate_mfr_part_number: C1005X7R1H103K050BE; Part_type: CAPACITORS\CERAMIC; Mfr_part_number: C0402C103K5RACTU; Mfr_name: KEMET; Mistral Part No: 120009030025-R; Wattage: NA; Custom_Duty: 15%; Customs_HS_Code: 85322990; Project: G4_SVGA; Value: 0.01uF; PCB Footprint: CAP0402_0-75; Direct Alternate_mfr_name: TDK; Footprint Path: Y:\MIS_DATABASE\Library\ALTIUM_TOOL\PCB_FOOTPRINTS\Altium_Footprint_Lib.PcbLib; Library Path: Y:\MIS_DATABASE\Library\ALTIUM_TOOL\SCHEMATICS_PARTS\MS_DISCRETE_Library.schlib; MECHANICAL 3D STEP FILE: CAP0402_0-75; Temperature: -55°C+125°C; Weight: 0.65mg; Footprint Ref: CAP0402_0-75; Chkd/date: SHREESHAIL/301105; Crtd /date: MAZHAR/040505; Datasheet: Y:\MIS_DATABASE\DATASHEETS\CAPACITORS\KEMET-C-X7R.PDF; Height: 0.55MM; Library Ref: CAP; Distributor_part_number: 399-3066-1-ND; Distributor_name: DIGIKEY; Tolerance: 10%
C681 = CAP_Dup1: CAP CERAMIC 10uF 16V 20% X6S 0603; Part Reference: C681; Automotive Alternate_mfr_part_number: GRT188C81C106ME13D; Automotive Alternate_mfr_name: MURATA; Direct Alternate_mfr_part_number: CL10X106MO8NRNC; Direct Alternate_mfr_name: SAMSUNG; Mistral Part No: 120017010004-R; Mfr_part_number: GRM188C81C106MA73D; Part_type: CAPACITORS\CERAMIC; Project: TRMM_SMART-M_PS; Wattage: NA; Customs_HS_Code: 85322990; Custom_Duty: 15%; Value: 10uF; PCB Footprint: CAP0603_1; Footprint Path: Y:\MIS_DATABASE\Library\ALTIUM_TOOL\PCB_FOOTPRINTS\Altium_Footprint_Lib.PcbLib; Library Path: Y:\MIS_DATABASE\Library\ALTIUM_TOOL\SCHEMATICS_PARTS\MS_DISCRETE_Library.schlib; Footprint Ref: CAP0603_1; Mfr_name: MURATA; Tolerance: 20%; Distributor_name: DIGIKEY; Distributor_part_number: 490-7198-1-ND; Library Ref: CAP; Height: 0.90MM; Weight: 6.3mg; Temperature: -55°C+105°C; Datasheet: Y:\MIS_DATABASE\DATASHEETS\CAPACITORS\MURATA-GXX-SER_NOV17.PDF; Crtd /date: VASANTHA/170117; Chkd/date: VASANTHA/170117; MECHANICAL 3D STEP FILE: CAP0603_1
R393 = RESISTOR_Dup2: RES 240E 1/20W 1% 0201; Part Reference: R393; Part_type: RESISTORS\FIXED; Mfr_part_number: RC0201FR-07240RL; Mfr_name: YAGEO AMERICA; Mistral Part No: 110016110007-R; Part #: 103413-2401R; Custom_Duty: 15%; Customs_HS_Code: 85332119; Voltage: NA; Project: ALL_DATA_NANO_SOM; Value: 240E_1%; PCB Footprint: RES0201_0-5; MECHANICAL 3D STEP FILE: RES0201_0-5; Chkd/date: VASANTHA/251116; Crtd /date: MANIRAJA/241116; Datasheet: Y:\MIS_DATABASE\DATASHEETS\RESISTORS\RCXXXXL-SER_MAR18.PDF; Temperature: -55°C+125°C; Weight: 0.17mg; Height: 0.26MM; Library Ref: RESISTOR; Distributor_part_number: YAG2528CT-ND; Distributor_name: DIGIKEY; Wattage: 1/20W; Tolerance: 1%; Footprint Ref: RES0201_0-5; Library Path: Y:\MIS_DATABASE\Library\ALTIUM_TOOL\SCHEMATICS_PARTS\MS_DISCRETE_Library.schlib; Footprint Path: Y:\MIS_DATABASE\Library\ALTIUM_TOOL\PCB_FOOTPRINTS\Altium_Footprint_Lib.PcbLib; Manufacturer: YAGEO AMERICA
R399 = RESISTOR_Dup2: RES 240E 1/20W 1% 0201; Part Reference: R399; Mistral Part No: 110016110007-R; Mfr_name: YAGEO AMERICA; Mfr_part_number: RC0201FR-07240RL; Part_type: RESISTORS\FIXED; Project: ALL_DATA_NANO_SOM; Voltage: NA; Customs_HS_Code: 85332119; Custom_Duty: 15%; Value: 240E_1%; Wattage: 1/20W; Package: 0201; Distributor_name: DIGIKEY; Distributor_part_number: YAG2528CT-ND; Library Ref: RESISTOR; Height: 0.26MM; Weight: 0.17mg; Temperature: -55°C+125°C; Datasheet: Y:\MIS_DATABASE\DATASHEETS\RESISTORS\RCXXXXL-SER_MAR18.PDF; Crtd /date: MANIRAJA/241116; Chkd/date: VASANTHA/251116; MECHANICAL 3D STEP FILE: RES0201_0-5; Footprint Ref: RES0201_0-5; Library Path: Y:\MIS_DATABASE\Library\ALTIUM_TOOL\SCHEMATICS_PARTS\MS_DISCRETE_Library.schlib; Footprint Path: Y:\MIS_DATABASE\Library\ALTIUM_TOOL\PCB_FOOTPRINTS\Altium_Footprint_Lib.PcbLib; PCB Footprint: RES0201_0-5
R400 = RESISTOR_Dup2: RES 240E 1/20W 1% 0201; Part Reference: R400; Part_type: RESISTORS\FIXED; Mfr_part_number: RC0201FR-07240RL; Mfr_name: YAGEO AMERICA; Mistral Part No: 110016110007-R; Custom_Duty: 15%; Customs_HS_Code: 85332119; Voltage: NA; Project: ALL_DATA_NANO_SOM; Value: 240E_1%; Footprint Path: Y:\MIS_DATABASE\Library\ALTIUM_TOOL\PCB_FOOTPRINTS\Altium_Footprint_Lib.PcbLib; Library Path: Y:\MIS_DATABASE\Library\ALTIUM_TOOL\SCHEMATICS_PARTS\MS_DISCRETE_Library.schlib; Footprint Ref: RES0201_0-5; MECHANICAL 3D STEP FILE: RES0201_0-5; Chkd/date: VASANTHA/251116; Crtd /date: MANIRAJA/241116; Datasheet: Y:\MIS_DATABASE\DATASHEETS\RESISTORS\RCXXXXL-SER_MAR18.PDF; Temperature: -55°C+125°C; Weight: 0.17mg; Height: 0.26MM; Library Ref: RESISTOR; Distributor_part_number: YAG2528CT-ND; Distributor_name: DIGIKEY; Package: 0201; Wattage: 1/20W; PCB Footprint: RES0201_0-5
R409 = RESISTOR_Dup1: RES 1K 1/10W 1% 0402; Part Reference: R409; Manufacturer: PANASONIC-ECG; Part_type: RESISTORS\FIXED; Mfr_part_number: ERJ-2RKF1001X; Mistral Part No: 110009030411-R; Custom_Duty: 15%; Customs_HS_Code: 85332119; Voltage: NA; Project: VOCERA; Value: 1K_1%; Footprint Path: Y:\MIS_DATABASE\Library\ALTIUM_TOOL\PCB_FOOTPRINTS\Altium_Footprint_Lib.PcbLib; Library Path: Y:\MIS_DATABASE\Library\ALTIUM_TOOL\SCHEMATICS_PARTS\MS_DISCRETE_Library.schlib; MECHANICAL 3D STEP FILE: RES0402_0-5; Footprint Ref: RES0402_0-5; Library Ref: RESISTOR; Chkd/date: VASANTHA/281216; Crtd /date: MAZHAR/150506; Datasheet: Y:\MIS_DATABASE\DATASHEETS\RESISTORS\PAN-ERJSER_NOV17.PDF; Temperature: -55°C+155°C; Weight: 0.8mg; Height: 0.40MM; Distributor_part_number: P1.00KLCT-ND; Distributor_name: DIGIKEY; Package: 0402; Wattage: 1/10W; Tolerance: 1%; Mfr_name: PANASONIC-ECG; PCB Footprint: RES0402_0-5
R412 = RESISTOR_Dup2: RES 10K 1/16W 1% 0402; Part Reference: R412; Mistral Part No: 110015090015-R; Mfr_name: YAGEO AMERICA; Mfr_part_number: RC0402FR-0710KL; Part_type: RESISTORS\FIXED; Project: VOCERA; Voltage: NA; Customs_HS_Code: 85332119; Custom_Duty: 15%; Value: 10K_1%; PCB Footprint: RES0402_0-5; Footprint Path: Y:\MIS_DATABASE\Library\ALTIUM_TOOL\PCB_FOOTPRINTS\Altium_Footprint_Lib.PcbLib; Library Path: Y:\MIS_DATABASE\Library\ALTIUM_TOOL\SCHEMATICS_PARTS\MS_DISCRETE_Library.schlib; Footprint Ref: RES0402_0-5; Library Ref: RESISTOR; Tolerance: 1%; Wattage: 1/16W; Package: 0402; Distributor_name: DIGIKEY; Distributor_part_number: 311-10.0KLRTR-ND; Height: 0.40MM; Weight: 0.65mg; Temperature: -55°C+155°C; Datasheet: Y:\MIS_DATABASE\DATASHEETS\RESISTORS\RCXXXXL-SER_MAR18.PDF; Crtd /date: GEETHA/290506; Chkd/date: VASANTHA/201216; MECHANICAL 3D STEP FILE: RES0402_0-5
R420 = RESISTOR_Dup2: RES 10K 1/16W 1% 0402; Part Reference: R420; Mistral Part No: 110015090015-R; Mfr_name: YAGEO AMERICA; Mfr_part_number: RC0402FR-0710KL; Part_type: RESISTORS\FIXED; Project: VOCERA; Voltage: NA; Customs_HS_Code: 85332119; Custom_Duty: 15%; Value: 10K_1%; PCB Footprint: RES0402_0-5; Footprint Path: Y:\MIS_DATABASE\Library\ALTIUM_TOOL\PCB_FOOTPRINTS\Altium_Footprint_Lib.PcbLib; Library Path: Y:\MIS_DATABASE\Library\ALTIUM_TOOL\SCHEMATICS_PARTS\MS_DISCRETE_Library.schlib; Footprint Ref: RES0402_0-5; Library Ref: RESISTOR; Tolerance: 1%; Wattage: 1/16W; Package: 0402; Distributor_name: DIGIKEY; Distributor_part_number: 311-10.0KLRTR-ND; Height: 0.40MM; Weight: 0.65mg; Temperature: -55°C+155°C; Datasheet: Y:\MIS_DATABASE\DATASHEETS\RESISTORS\RCXXXXL-SER_MAR18.PDF; Crtd /date: GEETHA/290506; Chkd/date: VASANTHA/201216; MECHANICAL 3D STEP FILE: RES0402_0-5
R422 = RESISTOR_Dup2: RES 10K 1/16W 1% 0402; Part Reference: R422; Mistral Part No: 110015090015-R; Mfr_name: YAGEO AMERICA; Mfr_part_number: RC0402FR-0710KL; Part_type: RESISTORS\FIXED; Project: VOCERA; Voltage: NA; Customs_HS_Code: 85332119; Custom_Duty: 15%; Value: 10K_1%; PCB Footprint: RES0402_0-5; Footprint Path: Y:\MIS_DATABASE\Library\ALTIUM_TOOL\PCB_FOOTPRINTS\Altium_Footprint_Lib.PcbLib; Library Path: Y:\MIS_DATABASE\Library\ALTIUM_TOOL\SCHEMATICS_PARTS\MS_DISCRETE_Library.schlib; Footprint Ref: RES0402_0-5; Library Ref: RESISTOR; Tolerance: 1%; Wattage: 1/16W; Package: 0402; Distributor_name: DIGIKEY; Distributor_part_number: 311-10.0KLRTR-ND; Height: 0.40MM; Weight: 0.65mg; Temperature: -55°C+155°C; Datasheet: Y:\MIS_DATABASE\DATASHEETS\RESISTORS\RCXXXXL-SER_MAR18.PDF; Crtd /date: GEETHA/290506; Chkd/date: VASANTHA/201216; MECHANICAL 3D STEP FILE: RES0402_0-5
U28 = J7AHPSoC-EVM_BGA1414: IC AM69 SoC EVM MICROPROCESSOR BGA1414; Part Reference: U28; Mistral Part No: 141230020002; Mfr_name: TEXAS INSTRUMENTS; Part_type: ICS\DIGITAL\MICROPROCESSOR; SPLIT_INST: TRUE; SWAP_INFO: (S1+S2+S3+S4+S5+S6+S7+S8+S9+S10+S11+S12+S13+S14+S15+S16+S17+S18+S19+S20+S21+S22+S23+S24+S25+S26); Project: TI_J7AHP SK_BRD; Tolerance: NA; Customs_HS_Code: 85423100; Custom_Duty: 15%; Value: XJ784S45AALY; Footprint Ref: BGA1414_31-49_1230X1230_2-7; Mfr_part_number: XJ784S45AALY; Voltage: NA; Wattage: NA; Package: BGA1414; Distributor_name: NA; Distributor_part_number: NA; Library Ref: J7AHPSoC-EVM_BGA1414; Height: 2.70MM; Weight: NA; Temperature: NA; Datasheet: Y:\MIS_DATABASE\DATASHEETS\ICS\DIGITAL\MICROCONTROLLER\J7AHP-SoC-EVM.PDF; Crtd /date: ALVY/141221; Chkd/date: MANIRAJA/151221; RoHS: NA; MECHANICAL 3D STEP FILE: BGA1414_31-49_1230X1230_2-7; Library Path: Y:\MIS_DATABASE\Library\ALTIUM_TOOL\SCHEMATICS_PARTS\MS_MICROPROCESSOR_Library.schlib; Footprint Path: Y:\MIS_DATABASE\Library\ALTIUM_TOOL\PCB_FOOTPRINTS\Altium_Footprint_Lib.PcbLib; Manufacturer: TEXAS INSTRUMENTS; PCB Footprint: BGA1414_31-49_1230X1230_2-7
U36 = MT53D1024M32D4DT_VFBGA200: IC 8Gb AUTO LPDDR4/LPDDR4x SDRAM TFBGA200; Part Reference: U36; Manufacturer: MICRON; Part_type: ICS\DIGITAL\MEMORY; Mistral Part No: 141122010003-R; MECHANICAL 3D STEP FILE: WFBGA200_MT53E2G_400X570_1-2; Custom_Duty: 15%; Customs_HS_Code: 85423100; Wattage: NA; Project: J7AHP_PROTO_BRD; Value: MT53E2G32D4DE-046 AUT:C; PCB Footprint: WFBGA200_MT53DDS_400X570_1-2; Footprint Path: Y:\MIS_DATABASE\Library\ALTIUM_TOOL\PCB_FOOTPRINTS\Altium_Footprint_Lib.PcbLib; Library Path: Y:\MIS_DATABASE\Library\ALTIUM_TOOL\SCHEMATICS_PARTS\MS_MISCMEMORY_Library.schlib; Chkd/date: ALVY/170122; Crtd /date: MANIRAJA/170122; Datasheet: Y:\MIS_DATABASE\DATASHEETS\ICS\MEMORY\MT53EX-C-AUTO.PDF; Temperature: -40°C+125°C; Weight: NA; Height: 1.14MM; Library Ref: MT53D1024M32D4DT_VFBGA200; Distributor_part_number: NA; Distributor_name: NA; Package: TFBGA200; Voltage: NA; Tolerance: NA; Mfr_part_number: MT53E2G32D4DE-046 AUT:C; Mfr_name: MICRON; Footprint Ref: WFBGA200_MT53DDS_400X570_1-2